# EasyEDA Pro project VoidX-Mini-Stomp-X.eprj, schematic pedalBreakout_NEW
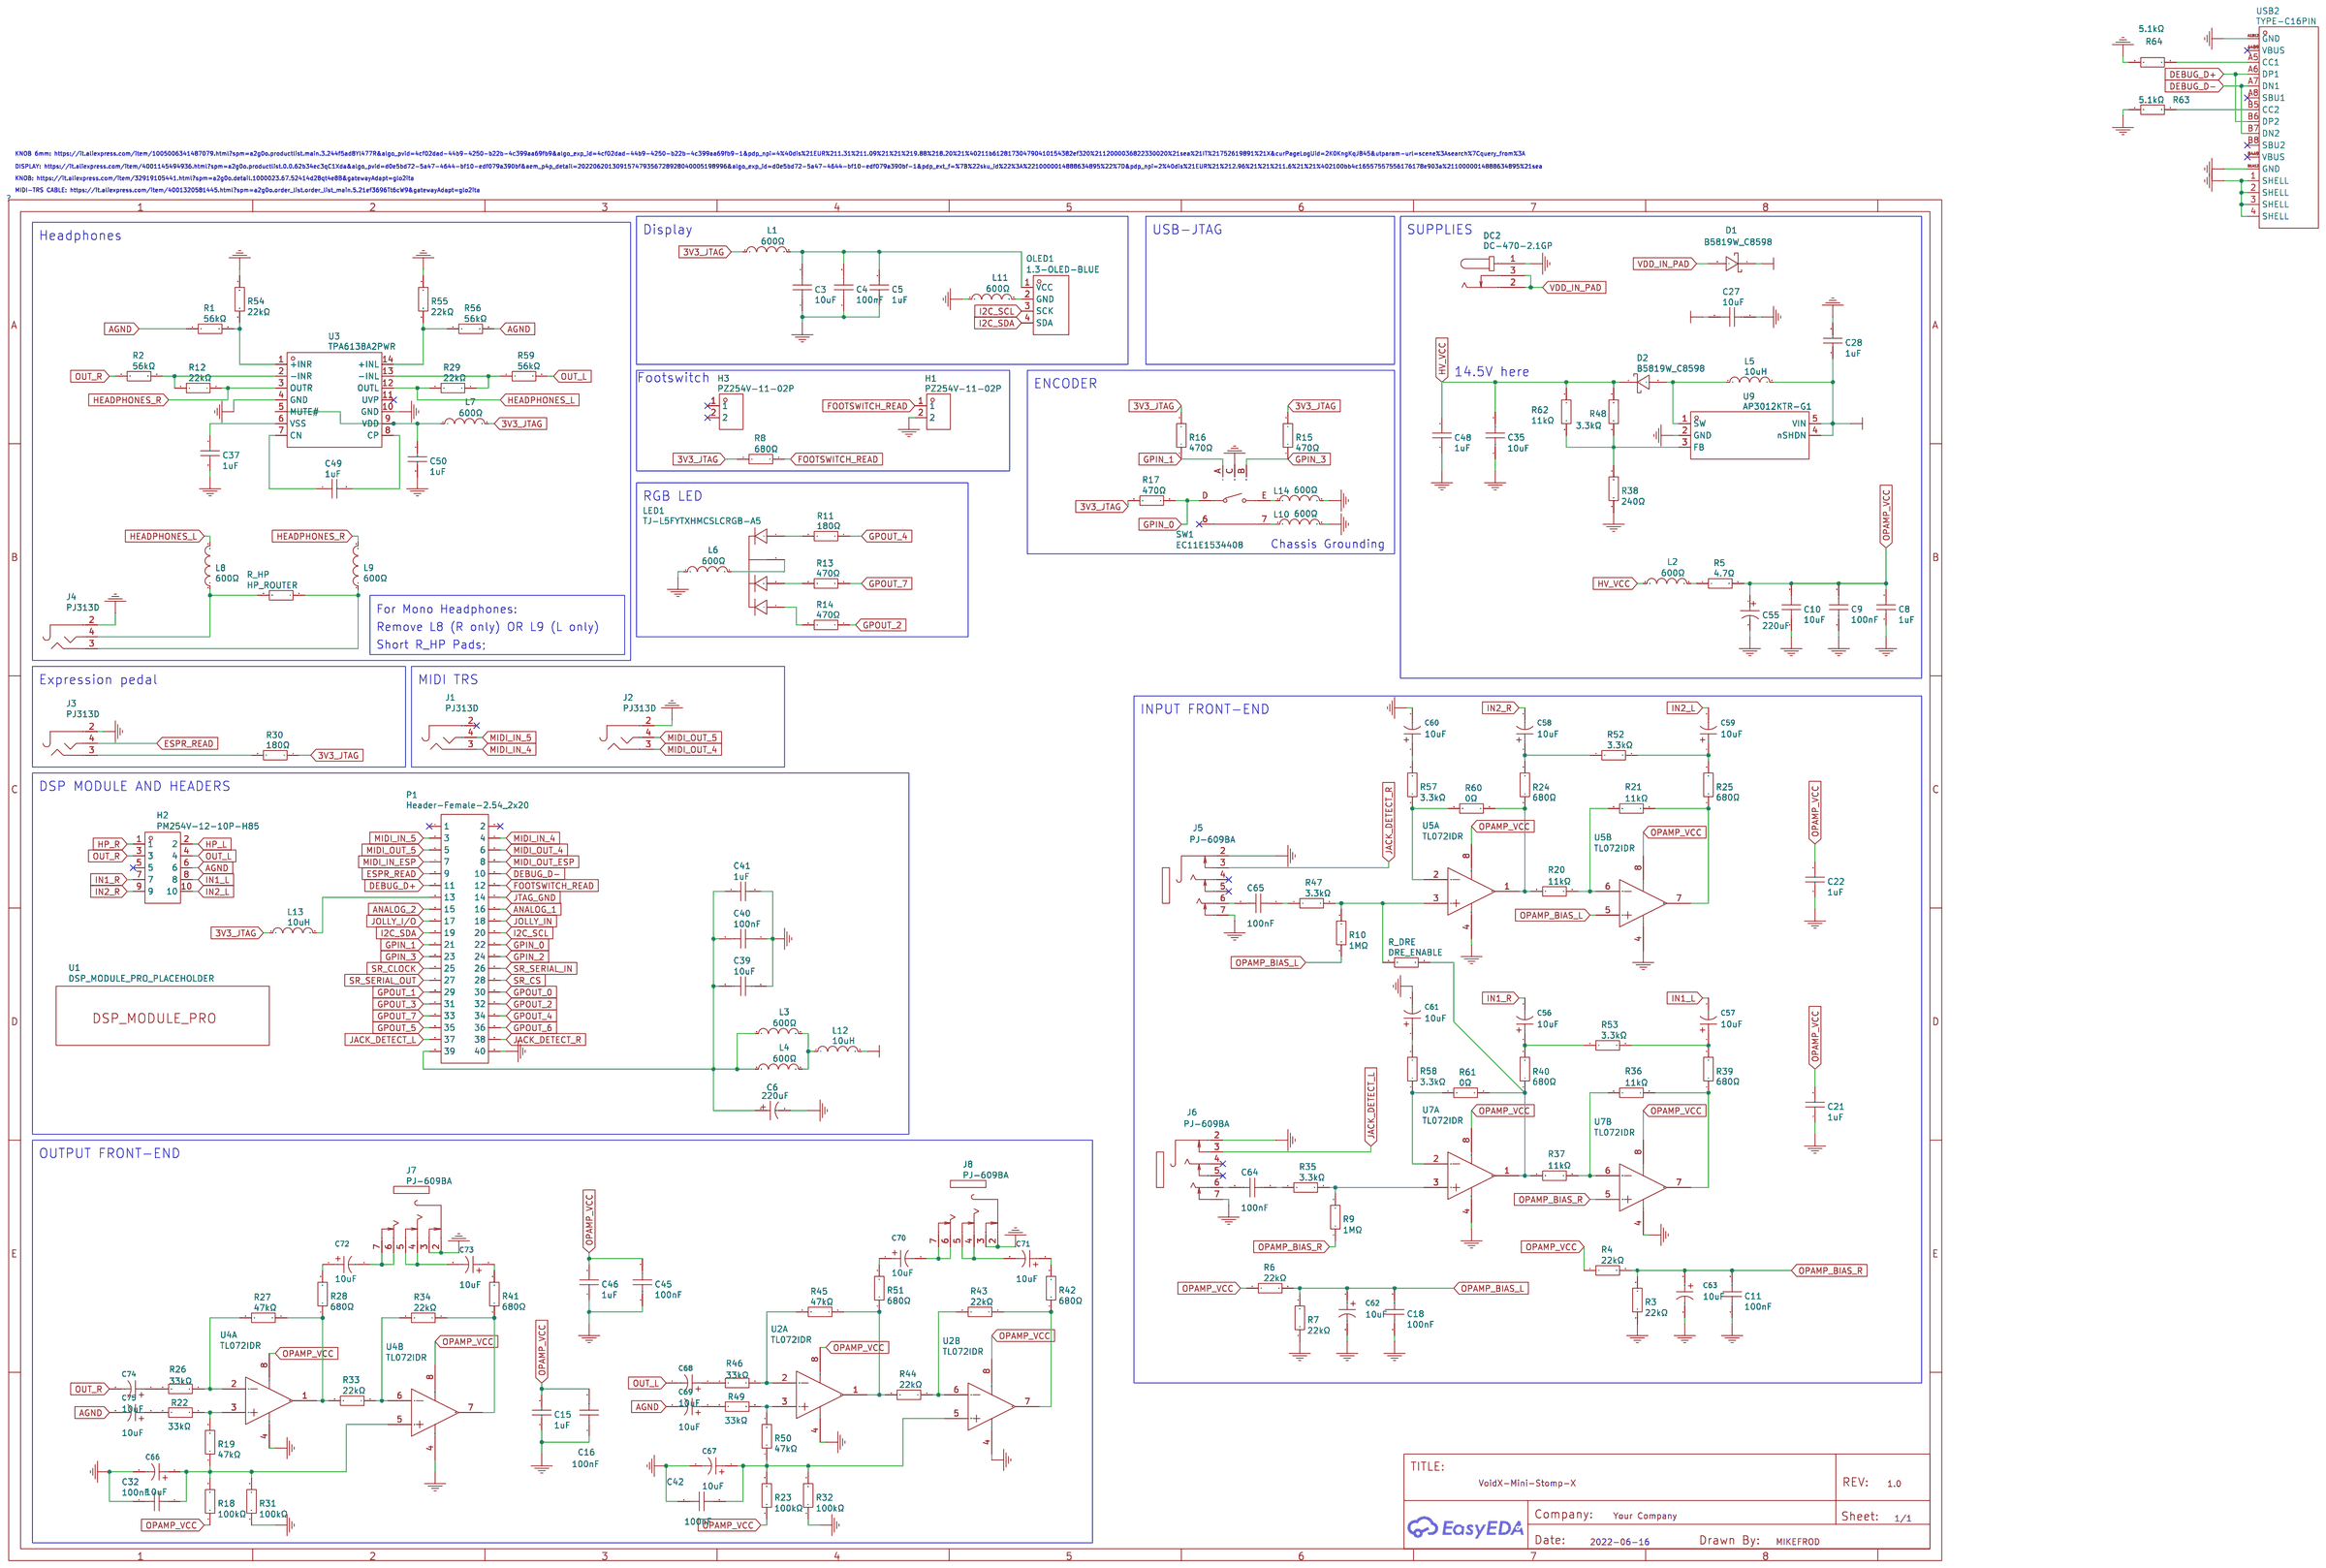
[diagram p0: schematic sheet]

## Parts
C3  10uF  [C0603]
C4  100nF  [C0603]
C5  1uF  [C0603]
C6  220uF  [CAP-SMD_BD6.3-L6.6-W6.6-FD]
C8  1uF  [C0603]
C9  100nF  [C0603]
C10  10uF  [C0603]
C11  100nF  [C0603]
C15  1uF  [C0603]
C16  100nF  [C0603]
C18  100nF  [C0603]
C21  1uF  [C0603]
C22  1uF  [C0603]
C27  10uF  [C0603]
C28  1uF  [C0603]
C32  100nF  [C0603]
C35  10uF  [C0603]
C37  1uF  [C0603]
C39  10uF  [C0603]
C40  100nF  [C0603]
C41  1uF  [C0603]
C42  100nF  [C0603]
C45  100nF  [C0603]
C46  1uF  [C0603]
C48  1uF  [C0603]
C49  1uF  [C0603]
C50  1uF  [C0603]
C55  220uF  [CAP-SMD_BD6.3-L6.6-W6.6-FD]
C56  10uF  [CAP-SMD_BD4.0-L4.3-W4.3-LS5.0-FD]
C57  10uF  [CAP-SMD_BD4.0-L4.3-W4.3-LS5.0-FD]
C58  10uF  [CAP-SMD_BD4.0-L4.3-W4.3-LS5.0-FD]
C59  10uF  [CAP-SMD_BD4.0-L4.3-W4.3-LS5.0-FD]
C60  10uF  [CAP-SMD_BD4.0-L4.3-W4.3-LS5.0-FD]
C61  10uF  [CAP-SMD_BD4.0-L4.3-W4.3-LS5.0-FD]
C62  10uF  [CAP-SMD_BD4.0-L4.3-W4.3-LS5.0-FD]
C63  10uF  [CAP-SMD_BD4.0-L4.3-W4.3-LS5.0-FD]
C64  100nF  [C1206]
C65  100nF  [C1206]
C66  10uF  [CAP-SMD_BD4.0-L4.3-W4.3-LS5.0-FD]
C67  10uF  [CAP-SMD_BD4.0-L4.3-W4.3-LS5.0-FD]
C68  10uF  [CAP-SMD_BD4.0-L4.3-W4.3-LS5.0-FD]
C69  10uF  [CAP-SMD_BD4.0-L4.3-W4.3-LS5.0-FD]
C70  10uF  [CAP-SMD_BD4.0-L4.3-W4.3-LS5.0-FD]
C71  10uF  [CAP-SMD_BD4.0-L4.3-W4.3-LS5.0-FD]
C72  10uF  [CAP-SMD_BD4.0-L4.3-W4.3-LS5.0-FD]
C73  10uF  [CAP-SMD_BD4.0-L4.3-W4.3-LS5.0-FD]
C74  10uF  [CAP-SMD_BD4.0-L4.3-W4.3-LS5.0-FD]
C75  10uF  [CAP-SMD_BD4.0-L4.3-W4.3-LS5.0-FD]
D1  B5819W_C8598  [SOD-123_L2.7-W1.6-LS3.7-RD-1]
D2  B5819W_C8598  [SOD-123_L2.7-W1.6-LS3.7-RD-1]
DC2  DC-470-2.1GP  [DC-IN-TH_DC-470-2.1GP]
H1  PZ254V-11-02P  [HDR-TH_2P-P2.54-V-M]  (no BOM)
H2  PM254V-12-10P-H85  [HDR-TH_10P-P2.54-V-F-R2-C5-S2.54]
H3  PZ254V-11-02P  [HDR-TH_2P-P2.54-V-M]  (no BOM)
J1  PJ313D  [AUDIO-TH_PJ313D]
J2  PJ313D  [AUDIO-TH_PJ313D]
J3  PJ313D  [AUDIO-TH_PJ313D]
J4  PJ313D  [AUDIO-TH_PJ313D]
J5  PJ-609BA  [AUDIO-TH_PJ-609BA]
J6  PJ-609BA  [AUDIO-TH_PJ-609BA]
J7  PJ-609BA  [AUDIO-TH_PJ-609BA]
J8  PJ-609BA  [AUDIO-TH_PJ-609BA]
L1  600Ω  [L0603]
L2  600Ω  [L0603]
L3  600Ω  [L0603]
L4  600Ω  [L0603]
L5  10uH  [IND-SMD_L4.0-W4.0]
L6  600Ω  [L0603]
L7  600Ω  [L0603]
L8  600Ω  [L0603]
L9  600Ω  [L0603]
L10  600Ω  [L0603]
L11  600Ω  [L0603]
L12  10uH  [IND-SMD_L4.0-W4.0]
L13  10uH  [IND-SMD_L4.0-W4.0]
L14  600Ω  [L0603]
LED1  TJ-L5FYTXHMCSLCRGB-A5  [LED-TH_4P-BD5.8-P1.30]
OLED1  1.3-OLED-BLUE  [1.3-OLED-BLUE]  (no BOM)
P1  Header-Female-2.54_2x20  [HDR-TH_40P-P2.54-V-F-R2-C20-S2.54]
R1  56kΩ  [R0603]
R2  56kΩ  [R0603]
R3  22kΩ  [R0603]
R4  22kΩ  [R0603]
R5  4.7Ω  [R0603]
R6  22kΩ  [R0603]
R7  22kΩ  [R0603]
R8  680Ω  [R0603]
R9  1MΩ  [R0603]
R10  1MΩ  [R0603]
R11  180Ω  [R0603]
R12  22kΩ  [R0603]
R13  470Ω  [R0603]
R14  470Ω  [R0603]
R15  470Ω  [R0603]
R16  470Ω  [R0603]
R17  470Ω  [R0603]
R18  100kΩ  [R0603]
R19  47kΩ  [R0603]
R20  11kΩ  [R0603]
R21  11kΩ  [R0603]
R22  33kΩ  [R0603]
R23  100kΩ  [R0603]
R24  680Ω  [R0603]
R25  680Ω  [R0603]
R26  33kΩ  [R0603]
R27  47kΩ  [R0603]
R28  680Ω  [R0603]
R29  22kΩ  [R0603]
R30  180Ω  [R0603]
R31  100kΩ  [R0603]
R32  100kΩ  [R0603]
R33  22kΩ  [R0603]
R34  22kΩ  [R0603]
R35  3.3kΩ  [R0603_NEW]
R36  11kΩ  [R0603]
R37  11kΩ  [R0603]
R38  240Ω  [R0603]
R39  680Ω  [R0603]
R40  680Ω  [R0603]
R41  680Ω  [R0603]
R42  680Ω  [R0603]
R43  22kΩ  [R0603]
R44  22kΩ  [R0603]
R45  47kΩ  [R0603]
R46  33kΩ  [R0603]
R47  3.3kΩ  [R0603_NEW]
R48  3.3kΩ  [R0603_NEW]
R49  33kΩ  [R0603]
R50  47kΩ  [R0603]
R51  680Ω  [R0603]
R52  3.3kΩ  [R0603_NEW]
R53  3.3kΩ  [R0603_NEW]
R54  22kΩ  [R0603]
R55  22kΩ  [R0603]
R56  56kΩ  [R0603]
R57  3.3kΩ  [R0603_NEW]
R58  3.3kΩ  [R0603_NEW]
R59  56kΩ  [R0603]
R60  0Ω  [R0805]
R61  0Ω  [R0805]
R62  11kΩ  [R0603]
R63  5.1kΩ  [R0603]
R64  5.1kΩ  [R0603]
R_DRE  DRE_ENABLE  [R0603]  (no BOM)
R_HP  HP_ROUTER  [R0603]  (no BOM)
SW1  EC11E1534408  [SW-TH_EC11XXXXXXXX]  (no BOM)
U1  DSP_MODULE_PRO_PLACEHOLDER  [DSP_MODULE_PRO_FOOTPRINT]
U2  TL072IDR  [SOIC-8_L5.0-W4.0-P1.27-LS6.0-BL]  (sections 1,2)
U3  TPA6138A2PWR  [TSSOP-14_L5.0-W4.4-P0.65-LS6.4-BL]
U4  TL072IDR  [SOIC-8_L5.0-W4.0-P1.27-LS6.0-BL]  (sections 1,2)
U5  TL072IDR  [SOIC-8_L5.0-W4.0-P1.27-LS6.0-BL]  (sections 1,2)
U7  TL072IDR  [SOIC-8_L5.0-W4.0-P1.27-LS6.0-BL]  (sections 1,2)
U9  AP3012KTR-G1  [TSOT-23-5_L2.9-W1.6-P0.95-LS2.8-BL]
USB2  TYPE-C16PIN  [USB-C-SMD_TYPE-C16PIN]

## Library data of the parts
C3 C10 C27 C35 C39 = 10uF: link: https://item.szlcsc.com/362304.html; 3DModel: C0603_L1.6-W0.8-H0.8; Supplier: LCSC; Manufacturer: SAMSUNG(三星); Manufacturer Part: CL10A106MA8NRNC; Supplier Part: C96446; JLCPCB Part Class: Basic Part
C4 C9 C11 C16 C18 C32 C40 C42 C45 = 100nF: link: https://item.szlcsc.com/362304.html; 3DModel: C0603_L1.6-W0.8-H0.8; Supplier: LCSC; Manufacturer: YAGEO; Manufacturer Part: CC0603KRX7R9BB104; Supplier Part: C14663; JLCPCB Part Class: Basic Part
C5 C8 C15 C21 C22 C28 C37 C41 C46 C48-C50 = 1uF: link: https://item.szlcsc.com/362304.html; 3DModel: C0603_L1.6-W0.8-H0.8; Supplier: LCSC; Manufacturer Part: CL10A105KB8NNNC; Manufacturer: SAMSUNG(三星); Supplier Part: C15849; JLCPCB Part Class: Basic Part
C6 C55 = 220uF: link: https://item.szlcsc.com/265679.html; Supplier: LCSC; Manufacturer: SEMTECH; Manufacturer Part: CK1C221M-CRE77; Supplier Part: C131158; JLCPCB Part Class: Extended Part
C56-C63 C66-C75 = RVE1C100M0405: Capacitance: Tolerance:±20% Tolerance:±20% Rated Voltage: φD: Operating Temperature:-55℃~+105℃ Operating Temperature:-55℃~+105℃; LCSC Part Name: 10uF ±20% 16V; Supplier Part: C2895765; Manufacturer: HONOR(荣誉); Supplier Footprint: SMD,D4xL5.4mm; JLCPCB Part Class: Extended Part; Datasheet: https://atta.szlcsc.com/upload/public/pdf/source/20210928/1A5E12F0220CAC3C2CE97EA5F0D9F8AD.pdf; Supplier: LCSC; Tolerance: ±20%; Operating Temperature: -55℃~+105℃
C64 C65 = 1206N104J500CT: Capacitance: Tolerance:±5% Tolerance:±5% Voltage Rated: Temperature Coefficient:; LCSC Part Name: 100nF ±5% 50V; Supplier Part: C170182; Manufacturer: Walsin(华新科); Supplier Footprint: 1206; JLCPCB Part Class: Extended Part; Datasheet: https://atta.szlcsc.com/upload/public/pdf/source/20190524/C388053_0CD3F469255EF43E616A57DAC128F58D.pdf; Supplier: LCSC; Tolerance: ±5%
D1 D2 = B5819W_C8598: link: https://atta.szlcsc.com/upload/public/pdf/source/20210423/C2828417_EF1BF8BE3D48F97E320B09B073C89160.pdf; Supplier: LCSC; Manufacturer: CJ; Manufacturer Part: B5819W; Supplier Part: C8598; JLCPCB Part Class: Basic Part
DC2 = DC-470-2.1GP: link: https://so.szlcsc.com/global.html?c=&k=C194407; 3DModel: DC-IN-TH_L14.0-W8.9-H10.9; Supplier: LCSC; Supplier Part: C194407; Manufacturer: GANGYUAN; JLCPCB Part Class: Extended Part
H1 H3 = PZ254V-11-02P: link: https://lcsc.com/product-detail/Pin-Header-Female-Header_Made-in-China-Made-in-China-2-54mm-1-2P_C36717.html; 3DModel: HDR2.54-M-LI-1X2P; JLCPCB Part Class: Extended Part
H2 = PM254V-12-10P-H85: link: https://item.szlcsc.com/31176.html; 3DModel: HDR2.54-F-LI-2X5P; Supplier: LCSC; Supplier Part: C492399; Manufacturer: XFCN; JLCPCB Part Class: Extended Part
J1-J4 = PJ313D: link: https://item.szlcsc.com/18860.html; 3DModel: AUDIO-PJ313D_L14.0-W6.0-H5.0; Supplier: LCSC; Manufacturer: BOOMELE; Supplier Part: C18167; JLCPCB Part Class: Extended Part
J5-J8 = PJ-609BA: link: https://item.szlcsc.com/292938.html; Supplier: LCSC; Supplier Part: C309277; Manufacturer: HOOYA(皓宇电子); JLCPCB Part Class: Extended Part
L1-L4 L6-L11 L14 = 600Ω: link: https://item.szlcsc.com/344093.html; 3DModel: L0603_L1.6-W0.8-H0.5_BEAD; Supplier: LCSC; Manufacturer: Sunlord(顺络); Manufacturer Part: GZ1608D601TF; Supplier Part: C1002; JLCPCB Part Class: Basic Part
L5 L12 L13 = 10uH: link: https://item.szlcsc.com/109498.html; 3DModel: IND-SMD_L4.0-W4.0-H1.9; Supplier: LCSC; Manufacturer: Sunlord; Manufacturer Part: SWPA4030S100MT; Supplier Part: C38117; JLCPCB Part Class: Extended Part
LED1 = TJ-L5FYTXHMCSLCRGB-A5: link: https://item.szlcsc.com/310427.html; 3DModel: LED-TH_4P-BD5.8-P1.30-RGB; Supplier: LCSC; Supplier Part: C330759; Manufacturer: TOGIALED(统佳); JLCPCB Part Class: Extended Part
OLED1 = 1.3-OLED-BLUE: link: https://www.aliexpress.com/item/32916757399.html?spm=a2g0s.8937460.0.0.77642e0euthJCb; Manufacturer: N/A; Manufacturer Part: N/A; Supplier Part: N/A; 3DModel: 0.96OLED_4P
P1 = Header-Female-2.54_2x20: link: https://item.szlcsc.com/2776437.html?ref=editor&logined=true; 3DModel: HDR-TH_40P-P2.54-F-LI-2X20P; Supplier: LCSC; Manufacturer: ZHOURI(洲日); Manufacturer Part: 2.54mm 2*20PFemale header; Supplier Part: C2977589; JLCPCB Part Class: Extended Part
R1 R2 R56 R59 = 56kΩ: 3DModel: R0603_L1.6-W0.8-H0.8; link: https://www.mouser.in/datasheet/2/447/PYu_RT_1_to_0_01_RoHS_L_11-1669912.pdf; Supplier: LCSC; Manufacturer: UNI-ROYAL(厚声); Manufacturer Part: 0603WAF5602T5E; Supplier Part: C23206; Resistance: 56K; JLCPCB Part Class: Basic Part
R3 R4 R6 R7 R33 R34 R43 R44 = 22kΩ: 3DModel: R0603_L1.6-W0.8-H0.8; link: https://www.mouser.in/datasheet/2/447/PYu_RT_1_to_0_01_RoHS_L_11-1669912.pdf; Supplier: LCSC; Manufacturer: UniOhm; Manufacturer Part: 0603WAF2202T5E; Supplier Part: C31850; Resistance: 22K; JLCPCB Part Class: Basic Part
R5 = 4.7Ω: 3DModel: R0603_L1.6-W0.8-H0.8; link: https://www.mouser.in/datasheet/2/447/PYu_RT_1_to_0_01_RoHS_L_11-1669912.pdf; Supplier: LCSC; Manufacturer: UniOhm; Manufacturer Part: 0603WAF470KT5E; Supplier Part: C23164; Resistance: 4.7; JLCPCB Part Class: Basic Part
R8 R24 R25 R28 R39-R42 R51 = 680Ω: 3DModel: R0603_L1.6-W0.8-H0.8; link: https://www.mouser.in/datasheet/2/447/PYu_RT_1_to_0_01_RoHS_L_11-1669912.pdf; Supplier: LCSC; Manufacturer: UniOhm; Manufacturer Part: 0603WAF6800T5E; Supplier Part: C23228; Resistance: 680; JLCPCB Part Class: Basic Part
R9 R10 = 1MΩ: link: https://www.mouser.in/datasheet/2/447/PYu_RT_1_to_0_01_RoHS_L_11-1669912.pdf; Supplier: LCSC; Manufacturer: UNI-ROYAL(厚声); Manufacturer Part: 0603WAF1004T5E; Supplier Part: C22935; Resistance: 1M; JLCPCB Part Class: Basic Part
R11 R30 = 180Ω: 3DModel: R0603_L1.6-W0.8-H0.8; link: https://www.mouser.in/datasheet/2/447/PYu_RT_1_to_0_01_RoHS_L_11-1669912.pdf; Supplier: LCSC; Manufacturer: UniOhm; Manufacturer Part: 0603WAF1800T5E; Supplier Part: C22828; Resistance: 180; JLCPCB Part Class: Basic Part
R12 R29 R54 R55 = 47kΩ: 3DModel: R0603_L1.6-W0.8-H0.8; link: https://www.mouser.in/datasheet/2/447/PYu_RT_1_to_0_01_RoHS_L_11-1669912.pdf; Supplier: LCSC; Manufacturer: UNI-ROYAL(厚声); Manufacturer Part: 0603WAF2202T5E; Supplier Part: C31850; Resistance: 47K; JLCPCB Part Class: Basic Part
R13-R17 = 470Ω: 3DModel: R0603_L1.6-W0.8-H0.8; link: https://www.mouser.in/datasheet/2/447/PYu_RT_1_to_0_01_RoHS_L_11-1669912.pdf; Supplier: LCSC; Manufacturer: UniOhm; Manufacturer Part: 0603WAF4700T5E; Supplier Part: C23179; Resistance: 470; JLCPCB Part Class: Basic Part
R18 R23 R31 R32 = 100kΩ: link: https://www.mouser.in/datasheet/2/447/PYu_RT_1_to_0_01_RoHS_L_11-1669912.pdf; Supplier: LCSC; Manufacturer: UNI-ROYAL(厚声); Manufacturer Part: 0603WAF1003T5E; Supplier Part: C25803; JLCPCB Part Class: Basic Part
R19 R27 R45 R50 = 47kΩ: 3DModel: R0603_L1.6-W0.8-H0.8; link: https://www.mouser.in/datasheet/2/447/PYu_RT_1_to_0_01_RoHS_L_11-1669912.pdf; Supplier: LCSC; Manufacturer: UNI-ROYAL(厚声); Manufacturer Part: 0603WAF4702T5E; Supplier Part: C25819; Resistance: 47K; JLCPCB Part Class: Basic Part
R20 R21 R36 R37 R62 = 11kΩ: 3DModel: R0603_L1.6-W0.8-H0.8; link: https://www.mouser.in/datasheet/2/447/PYu_RT_1_to_0_01_RoHS_L_11-1669912.pdf; Supplier: LCSC; Manufacturer: UniOhm; Manufacturer Part: 0603WAF1102T5E; Supplier Part: C25950; Resistance: 11K; JLCPCB Part Class: Basic Part
R22 R26 R46 R49 = 33kΩ: 3DModel: R0603_L1.6-W0.8-H0.8; link: https://www.mouser.in/datasheet/2/447/PYu_RT_1_to_0_01_RoHS_L_11-1669912.pdf; Supplier: LCSC; Manufacturer: UNI-ROYAL(厚声); Manufacturer Part: 0603WAF3302T5E; Supplier Part: C4216; Resistance: 33K; JLCPCB Part Class: Basic Part
R35 R47 R52 R53 R57 R58 = 3.3kΩ: link: https://item.szlcsc.com/137208.html; 3DModel: R0603_L1.6-W0.8-H0.8; Supplier: LCSC; Manufacturer: UNI-ROYAL(厚声); Manufacturer Part: 0603WAF3301T5E; Supplier Part: C22978; Resistance: 3.3K; JLCPCB Part Class: Basic Part
R38 = 240Ω: link: https://www.mouser.in/datasheet/2/447/PYu_RT_1_to_0_01_RoHS_L_11-1669912.pdf; Supplier: LCSC; Manufacturer: UNI-ROYAL(厚声); Manufacturer Part: 0603WAF2400T5E; Supplier Part: C23350; Resistance: 240; JLCPCB Part Class: Basic Part
R48 = 3.3kΩ: link: https://item.szlcsc.com/137208.html; 3DModel: R0603_L1.6-W0.8-H0.8; Supplier: LCSC; Manufacturer: UniOhm; Manufacturer Part: 0603WAF3301T5E; Supplier Part: C22978; Resistance: 3.3K; JLCPCB Part Class: Basic Part
R60 R61 = 0Ω: link: https://item.szlcsc.com/142685.html; 3DModel: R0805_L2.0-W1.3-H0.6; Supplier: LCSC; Manufacturer: UNI-ROYAL(厚声); Manufacturer Part: 0805W8F0000T5E; Supplier Part: C17477; JLCPCB Part Class: Basic Part
R63 R64 = 5.1kΩ: Supplier: LCSC; Manufacturer Part: 0603WAF5101T5E; Manufacturer: UNI-ROYAL(厚声); Supplier Part: C23186; JLCPCB Part Class: Basic Part
R_DRE = DRE_ENABLE: 3DModel: R0603_L1.6-W0.8-H0.8; link: https://www.mouser.in/datasheet/2/447/PYu_RT_1_to_0_01_RoHS_L_11-1669912.pdf
R_HP = HP_ROUTER: 3DModel: R0603_L1.6-W0.8-H0.8; link: https://www.mouser.in/datasheet/2/447/PYu_RT_1_to_0_01_RoHS_L_11-1669912.pdf
SW1 = EC11E1534408: link: https://so.szlcsc.com/global.html?c=&k=C202365; 3DModel: SW-TH_EC11XXXXXXXX-L11.7-W12.0-H24.5-P2.5-LS14.5; Supplier: LCSC; Supplier Part: C278348; Manufacturer: ALPS Electric; JLCPCB Part Class: Extended Part
U1 = DSP_MODULE_PRO_PLACEHOLDER
U2 U4 U5 U7 = TL072IDR: link: https://item.szlcsc.com/417287.html; 3DModel: SOIC-8_L4.9-W3.9-H1.7-LS6.0-P1.27; tags: FET Operational Amplifier; image: http://image.lceda.cn/szlcsc/C6962.jpg; Supplier Part: C6962; Supplier: LCSC; Manufacturer: TI(德州仪器); JLCPCB Part Class: Extended Part
U3 = TPA6138A2PWR: link: https://item.szlcsc.com/8137.html; 3DModel: TSSOP-14_L5.0-W4.4-H1.0-LS6.4-P0.65; Supplier: LCSC; Supplier Part: C183097; Manufacturer: TI(德州仪器); JLCPCB Part Class: Extended Part
U9 = AP3012KTR-G1: link: https://item.szlcsc.com/233411.html; 3DModel: TSOT-23-5_L2.9-W1.6-H1.00-LS2.8-P0.95; Supplier: LCSC; Supplier Part: C102618; Manufacturer: DIODES(美台); JLCPCB Part Class: Extended Part
USB2 = TYPE-C16PIN: Supplier: LCSC; Supplier Part: C393939; Manufacturer: SHOU HAN(首韩); JLCPCB Part Class: Extended Part

## Nets
3V3_JTAG: L1.1 L7.2 L13.1 R8.1 R15.2 R16.2 R17.2 R30.1
+5V: C27.2 C28.1 D1.1(-) L5.2 L12.2 U9.4(nSHDN) U9.5(VIN)
AGND: C69.2 C75.2 H2.6 R1.1 R56.2
GND: C3.1 C4.1 C5.1 C6.2 C8.1 C9.1 C10.1 C11.1 C15.1 C16.1 C18.1 C21.1 C22.1 C27.1 C28.2 C32.2 C35.1 C37.2 C39.1 C40.1 C41.1 C42.2 C45.1 C46.1 C48.1 C50.2 C55.2 C60.2 C61.2 C62.2 C63.2 C66.2 C67.2 DC2.1 H1.2 J2.2 J3.2 J4.2 J5.2 J5.7 J6.2 J6.7 J7.2 J7.3 J8.2 J8.3 L6.1 L10.2 L11.1 L14.2 P1.40 R3.1 R7.1 R31.1 R32.1 R38.1 R54.1 R55.1 R63.1 R64.1 SW1.C U2.4(VCC-) U3.4(GND) U3.10(GND) U4.4(VCC-) U5.4(VCC-) U7.4(VCC-) U9.2(GND) USB2.1(SHELL) USB2.2(SHELL) USB2.3(SHELL) USB2.4(SHELL) USB2.A1B12(GND) USB2.B1A12(GND)
VDD_IN_PAD: D1.2(+) DC2.2 DC2.3
ANALOG_1: P1.16
ANALOG_2: P1.15
DEBUG_D+: P1.11 USB2.A6(DP1) USB2.B6(DP2)
DEBUG_D-: P1.10 USB2.A7(DN1) USB2.B7(DN2)
ESPR_READ: J3.4 P1.9
FOOTSWITCH_READ: H1.1 P1.12 R8.2
GPIN_0: P1.22 R17.1 SW1.D
GPIN_1: P1.21 R16.1 SW1.A
GPIN_2: P1.24
GPIN_3: P1.23 R15.1 SW1.B
GPOUT_0: P1.30
GPOUT_1: P1.29
GPOUT_2: P1.32 R14.1
GPOUT_3: P1.31
GPOUT_4: P1.34 R11.1
GPOUT_5: P1.35
GPOUT_6: P1.36
GPOUT_7: P1.33 R13.1
HEADPHONES_L: L8.2 R29.2 U3.12(OUTL)
HEADPHONES_R: L9.2 R12.1 U3.3(OUTR)
HP_L: H2.2
HP_R: H2.1
HV_VCC: C35.2 C48.2 D2.1(-) L2.1 R48.2 R62.1
I2C_SCL: OLED1.3(SCK) P1.20
I2C_SDA: OLED1.4(SDA) P1.19
IN1_L: C57.2 H2.8
IN1_R: C56.2 H2.7
IN2_L: C59.2 H2.10
IN2_R: C58.2 H2.9
JACK_DETECT_L: J6.3 P1.37
JACK_DETECT_R: J5.3 P1.38
JOLLY_I/O: P1.17
JOLLY_IN: P1.18
JTAG_GND: P1.14
MIDI_IN_4: J1.3 P1.4
MIDI_IN_5: J1.4 P1.3
MIDI_IN_ESP: P1.7
MIDI_OUT_4: J2.3 P1.6
MIDI_OUT_5: J2.4 P1.5
MIDI_OUT_ESP: P1.8
OPAMP_BIAS_L: C18.2 C62.1 R6.2 R7.2 R10.1 U5.5(IN2+)
OPAMP_BIAS_R: C11.2 C63.1 R3.2 R4.2 R9.1 U7.5(IN2+)
OPAMP_VCC: C8.2 C9.2 C10.2 C15.2 C16.2 C21.2 C22.2 C45.2 C46.2 C55.1 R4.1 R5.2 R6.1 R18.1 R23.1 U2.8(VCC+) U4.8(VCC+) U5.8(VCC+) U7.8(VCC+)
OUT_L: C68.2 H2.4 R59.2
OUT_R: C74.2 H2.3 R2.1
SR_CLOCK: P1.25
SR_CS: P1.28
SR_SERIAL_IN: P1.26
SR_SERIAL_OUT: P1.27
$1N49: L11.2 OLED1.2(GND)
$1N55: LED1.1 R11.2
$1N56: LED1.4 R14.2
$1N57: LED1.3 R13.2
$1N79: J3.3 R30.2
$1N88: L2.2 R5.1
$1N89: L3.2 L4.2 L12.1
$1N90: C6.1 C39.2 C40.2 C41.2 L3.1 L4.1 P1.39
$1N94: C3.2 C4.2 C5.2 L1.2 OLED1.1(VCC)
$1N105: R20.2 R24.1 R60.2 U5.1(OUT1)
$1N107: R20.1 R21.2 U5.6(IN2-)
$1N108: R21.1 R25.1 U5.7(OUT2)
$1N109: C58.1 R24.2 R52.1
$1N116: C56.1 R40.2 R53.1
$1N117: R36.1 R39.1 U7.7(OUT2)
$1N118: R36.2 R37.1 U7.6(IN2-)
$1N120: R37.2 R40.1 R61.2 R_DRE.1 U7.1(OUT1)
$1N125: R19.2 R22.2 U4.3(IN1+)
$1N126: C32.1 C66.1 R18.2 R19.1 R31.2 U4.5(IN2+)
$1N129: R26.2 R27.2 U4.2(IN1-)
$1N130: R27.1 R28.1 R33.2 U4.1(OUT1)
$1N131: R33.1 R34.2 U4.6(IN2-)
$1N132: R34.1 R41.1 U4.7(OUT2)
$1N134: C73.1 R41.2
$1N141: C71.1 R42.2
$1N143: R42.1 R43.1 U2.7(OUT2)
$1N144: R43.2 R44.1 U2.6(IN2-)
$1N145: R44.2 R45.1 R51.1 U2.1(OUT1)
$1N146: C42.1 C67.1 R23.2 R32.2 R50.1 U2.5(IN2+)
$1N148: R45.2 R46.2 U2.2(IN1-)
$1N150: R49.2 R50.2 U2.3(IN1+)
$1N162: D2.2(+) L5.1 U9.1(SW)
$1N168: R38.2 R48.1 R62.2 U9.3(FB)
$1N169: R9.2 R35.2 U7.3(IN1+)
$1N170: R10.2 R47.2 R_DRE.2 U5.3(IN1+)
$1N172: J4.4 L8.1 R_HP.2
$1N177: J4.3 L9.1 R_HP.1
$1N182: R1.2 R54.2 U3.1(+INR)
$1N183: R2.2 R12.2 U3.2(-INR)
$1N186: C37.1 U3.6(VSS)
$1N188: C49.1 U3.7(CN)
$1N189: C49.2 U3.8(CP)
$1N190: C50.1 L7.1 U3.5(MUTE#) U3.9(VDD)
$1N192: R55.2 R56.1 U3.14(+INL)
$1N196: R29.1 R59.1 U3.13(-INL)
$1N203: L10.1 SW1.7
$1N209: L13.2 P1.13
$1N233: L6.2 LED1.2(-)
$1N236: R57.1 R60.1 U5.2(IN1-)
$1N239: R58.1 R61.1 U7.2(IN1-)
$1N244: L14.1 SW1.E
$1N6334: R63.2 USB2.B5(CC2)
$1N6335: R64.2 USB2.A5(CC1)
$1N9655: C57.1 R39.2 R53.2
$1N12613: C59.1 R25.2 R52.2
$1N12712: C60.1 R57.2
$1N12761: C61.1 R58.2
$1N12936: C64.2 J6.6
$1N12941: C64.1 R35.1
$1N12984: C65.2 J5.6
$1N12989: C65.1 R47.1
$1N13475: C68.1 R46.1
$1N13529: C69.1 R49.1
$1N13586: C70.1 R51.2
$1N13708: C70.2 J8.6 J8.7
$1N13767: C71.2 J8.4 J8.5
$1N13875: C73.2 J7.4 J7.5
$1N13898: C72.1 R28.2
$1N13906: C72.2 J7.6 J7.7
$1N13999: C75.1 R22.1
$1N14034: C74.1 R26.1

Not connected (* = marked no-connect by the designer): H2 5*; H3 1* 2*; J1 2*; J5 4* 5*; J6 4* 5*; P1 1* 2*; SW1 6*; U3 11(UVP)*; USB2 A4B9(VBUS)* A8(SBU1)* B4A9(VBUS)* B8(SBU2)*

## Notes on the sheet
- KNOB 6mm: https://it.aliexpress.com/item/1005006341487079.html?spm=a2g0o.productlist.main.3.244f5ad8Yl477R&algo_pvid=4cf02dad-44b9-4250-b22b-4c399aa69fb9&algo_exp_id=4cf02dad-44b9-4250-b22b-4c399aa69fb9-1&pdp_npi=4%40dis%21EUR%211.31%211.09%21%21%219.88%218.20%21%40211b612817304790410154382ef320%2112000036822330020%21sea%21IT%21752619891%21X&curPageLogUid=2K0KngKqJB45&utparam-url=scene%3Asearch%7Cquery_from%3A
- DISPLAY: https://it.aliexpress.com/item/4001145494936.html?spm=a2g0o.productlist.0.0.62b34ec3qC1Xda&algo_pvid=d0e5bd72-5a47-4644-bf10-edf079a390bf&aem_p4p_detail=202206201309157479356728928040005198996&algo_exp_id=d0e5bd72-5a47-4644-bf10-edf079a390bf-1&pdp_ext_f=%7B%22sku_id%22%3A%2210000014888634895%22%7D&pdp_npi=2%40dis%21EUR%21%212.96%21%21%211.6%21%21%402100bb4c16557557556176178e903a%2110000014888634895%21sea
- KNOB: https://it.aliexpress.com/item/32919105441.html?spm=a2g0o.detail.1000023.67.52414d28qt4e8B&gatewayAdapt=glo2ita
- MIDI-TRS CABLE: https://it.aliexpress.com/item/4001320581445.html?spm=a2g0o.order_list.order_list_main.5.21ef3696Tt6cW9&gatewayAdapt=glo2ita
- Headphones
- Display
- USB-JTAG
- SUPPLIES
- 14.5V here
- Footswitch
- ENCODER
- RGB LED
- Chassis Grounding
- For Mono Headphones:
- Remove L8 (R only) OR L9 (L only)
- Short R_HP Pads;
- Expression pedal
- MIDI TRS
- INPUT FRONT-END
- DSP MODULE AND HEADERS
- OUTPUT FRONT-END
